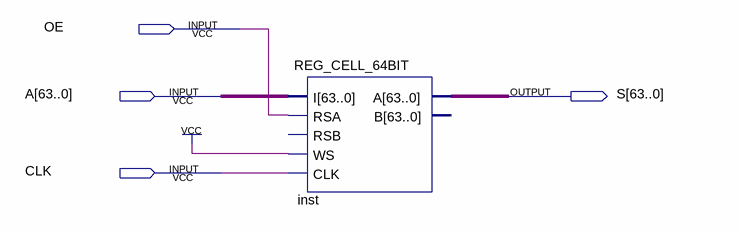
[diagram p0: schematic sheet]
// Quartus schematic REG_64BIT.bdf as structural Verilog: 1 symbols, 4 pins
module REG_64BIT (
  input  OE,
  input  [63:0] A,
  input  CLK,
  output [63:0] S
);

  REG_CELL_64BIT inst (.I(A), .RSA(OE), .WS(1'b1), .CLK(CLK), .A(S));  // open: RSB, B
endmodule
